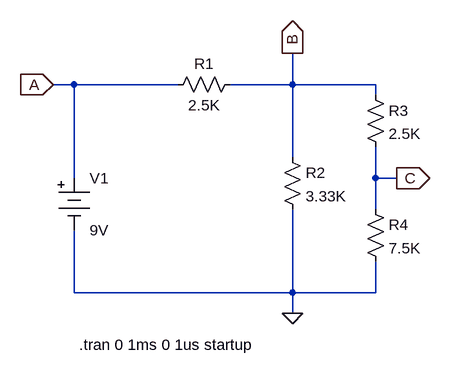
[diagram p0: schematic Resistive Network Circuits.asc]
Resistive Network Circuits.asc, the LTspice schematic file:
Version 4
SHEET 1 936 680
WIRE -144 -48 -176 -48
WIRE 16 -48 -144 -48
WIRE 192 -48 192 -96
WIRE 192 -48 96 -48
WIRE 320 -48 192 -48
WIRE 320 -32 320 -48
WIRE 192 64 192 -48
WIRE -144 96 -144 -48
WIRE 320 96 320 48
WIRE 352 96 320 96
WIRE 320 144 320 96
WIRE -144 272 -144 176
WIRE 192 272 192 144
WIRE 192 272 -144 272
WIRE 320 272 320 224
WIRE 320 272 192 272
WIRE 192 304 192 272
FLAG 192 304 0
FLAG 352 96 C
IOPIN 352 96 Out
FLAG -176 -48 A
IOPIN -176 -48 In
FLAG 192 -96 B
IOPIN 192 -96 Out
SYMBOL res 0 -32 R270
WINDOW 3 0 56 VBottom 2
WINDOW 0 32 56 VTop 2
SYMATTR Value 2.5K
SYMATTR InstName R1
SYMATTR SpiceLine tol=1 pwr=0.1
SYMBOL res 176 48 R0
SYMATTR InstName R2
SYMATTR Value 3.33K
SYMATTR SpiceLine tol=1 pwr=0.1
SYMBOL res 304 128 R0
SYMATTR InstName R4
SYMATTR Value 7.5K
SYMATTR SpiceLine tol=1 pwr=0.1
SYMBOL Misc\\battery -144 80 R0
WINDOW 123 0 0 Left 0
SYMATTR SpiceLine Rser=10
SYMATTR InstName V1
SYMATTR Value 9V
SYMBOL res 304 -48 R0
SYMATTR InstName R3
SYMATTR Value 2.5K
SYMATTR SpiceLine tol=1 pwr=0.1
TEXT -136 352 Left 2 !.tran 0 1ms 0 1us startup

The netlist it stands for:
* Resistive Network Circuits.asc
R1 A B 2.5K tol=1 pwr=0.1
R2 B 0 3.33K tol=1 pwr=0.1
R4 C 0 7.5K tol=1 pwr=0.1
V1 A 0 9V Rser=10
R3 B C 2.5K tol=1 pwr=0.1
.tran 0 1ms 0 1us startup
.backanno
.end